# EAGLE design Relay_output_driver_modul_4ch (EAGLE 7.5.0)
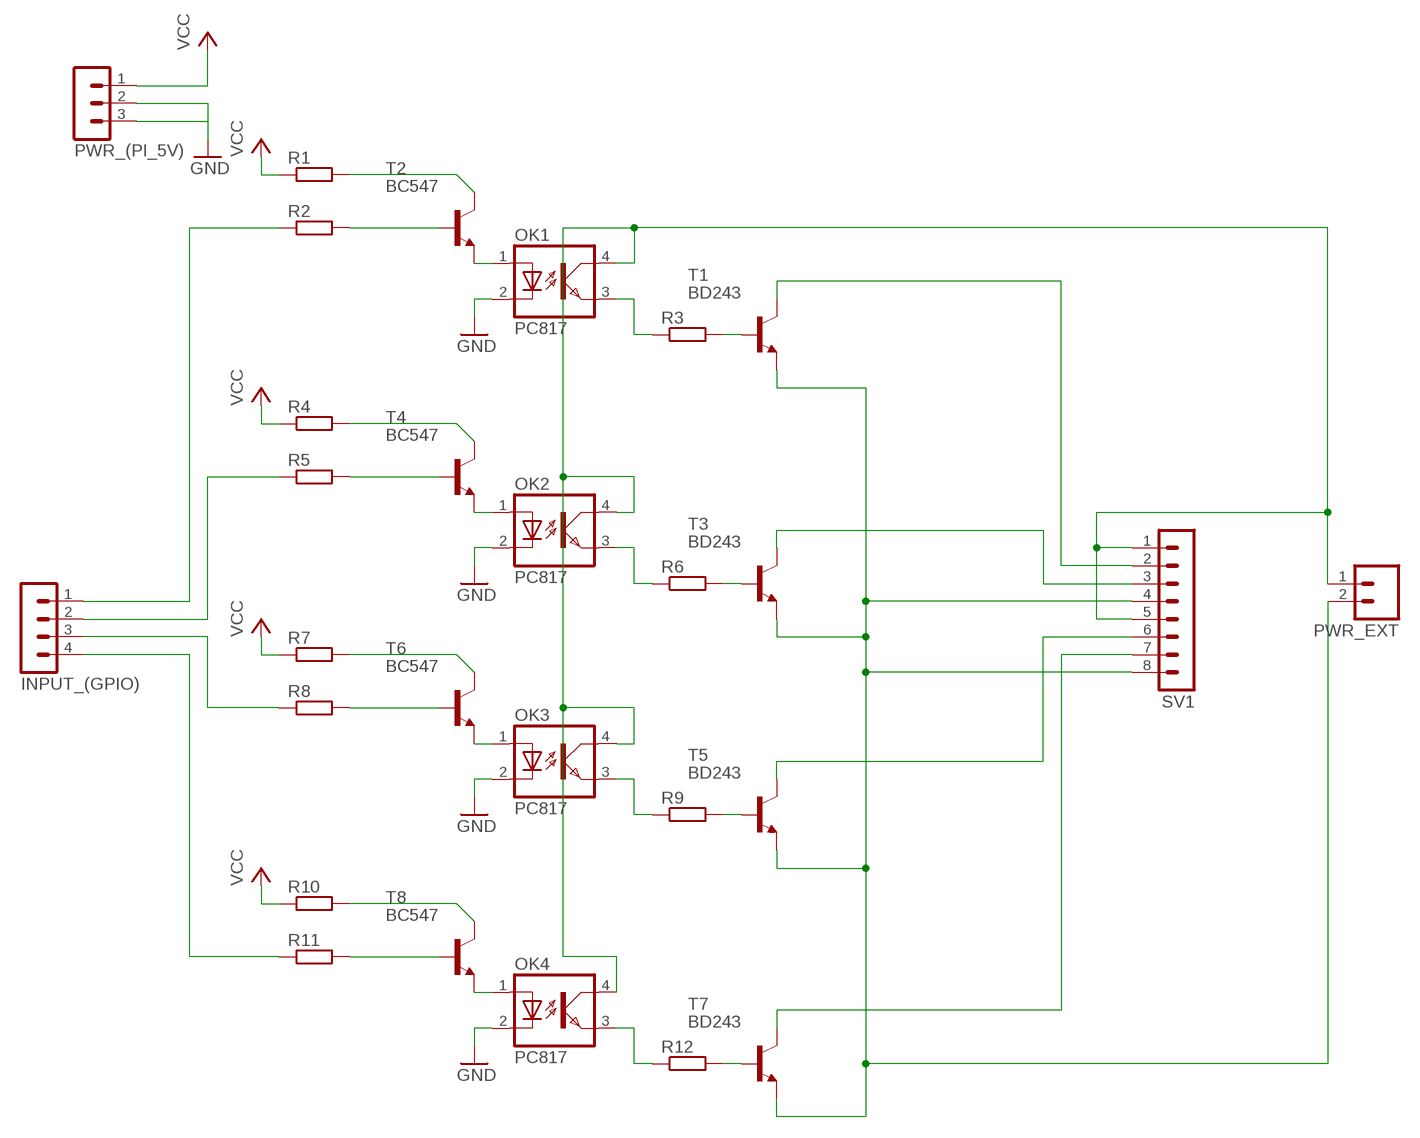
[diagram p0: schematic, sheet 1]

## Parts
INPUT_(GPIO)  MA04-1  [MA04-1]
OK1  PC817  [DIL04]
OK2  PC817  [DIL04]
OK3  PC817  [DIL04]
OK4  PC817  [DIL04]
PWR_(PI_5V)  MA03-1  [MA03-1]
PWR_EXT  MA02  [02PA]
R1  R-EU_0207/10  [0207/10]
R2  R-EU_0207/10  [0207/10]
R3  R-EU_0207/10  [0207/10]
R4  R-EU_0207/10  [0207/10]
R5  R-EU_0207/10  [0207/10]
R6  R-EU_0207/10  [0207/10]
R7  R-EU_0207/10  [0207/10]
R8  R-EU_0207/10  [0207/10]
R9  R-EU_0207/10  [0207/10]
R10  R-EU_0207/10  [0207/10]
R11  R-EU_0207/10  [0207/10]
R12  R-EU_0207/10  [0207/10]
SV1  MA08-1  [MA08-1]
T1  BD243  [TO220]
T2  BC547  [TO92]
T3  BD243  [TO220]
T4  BC547  [TO92]
T5  BD243  [TO220]
T6  BC547  [TO92]
T7  BD243  [TO220]
T8  BC547  [TO92]

## Nets
GND: OK1.2(C) OK2.2(C) OK3.2(C) OK4.2(C) PWR_(PI_5V).2 PWR_(PI_5V).3
INPUT_1: INPUT_(GPIO).1 R2.1
INPUT_2: INPUT_(GPIO).2 R5.1
INPUT_3: INPUT_(GPIO).3 R8.1
INPUT_4: INPUT_(GPIO).4 R11.1
N$1: OK1.1(A) T2.1(E)
N$2: R3.2 T1.1(B)
N$3: OK1.3(EMIT) R3.1
N$4: R2.2 T2.2(B)
N$5: R1.2 T2.3(C)
N$6: OK2.1(A) T4.1(E)
N$7: R6.2 T3.1(B)
N$8: OK2.3(EMIT) R6.1
N$9: R5.2 T4.2(B)
N$10: R4.2 T4.3(C)
N$11: OK3.1(A) T6.1(E)
N$12: R9.2 T5.1(B)
N$13: OK3.3(EMIT) R9.1
N$14: R8.2 T6.2(B)
N$15: R7.2 T6.3(C)
N$16: OK4.1(A) T8.1(E)
N$17: R12.2 T7.1(B)
N$18: OK4.3(EMIT) R12.1
N$19: R11.2 T8.2(B)
N$20: R10.2 T8.3(C)
OUTPUT_1: SV1.2 T1.2(C)
OUTPUT_2: SV1.3 T3.2(C)
OUTPUT_3: SV1.6 T5.2(C)
OUTPUT_4: SV1.7 T7.2(C)
PWR_EXT_5V: OK1.4(COL) OK2.4(COL) OK3.4(COL) OK4.4(COL) PWR_EXT.1 SV1.1 SV1.5
PWR_EXT_GND: PWR_EXT.2 SV1.4 SV1.8 T1.3(E) T3.3(E) T5.3(E) T7.3(E)
VCC: PWR_(PI_5V).1 R1.1 R4.1 R7.1 R10.1

## Library data of the parts
INPUT_(GPIO) = con-lstb:MA04-1: PIN HEADER; OC_FARNELL: unknown; OC_NEWARK: unknown
OK1-OK4 = optocoupler:PC817: SHARP OPTO COUPLER; MPN: PC817X4J000F; OC_FARNELL: 9707727; OC_NEWARK: 97K7059
PWR_(PI_5V) = con-lstb:MA03-1: PIN HEADER; OC_FARNELL: unknown; OC_NEWARK: unknown
PWR_EXT = con-amp-quick:MA02: AMP QUICK CONNECTOR; OC_FARNELL: unknown; OC_NEWARK: unknown
R1-R12 = rcl:R-EU_: RESISTOR, European symbol
SV1 = con-lstb:MA08-1: PIN HEADER; OC_FARNELL: unknown; OC_NEWARK: unknown
T1 T3 T5 T7 = transistor:BD243: NPN TRANSISTOR Source: Motorola Semiconductor, Master Selection Guide Q3/95 SG73 REV 8 page 5.5-4
T2 T4 T6 T8 = transistor:BC547: NPN TRANSISTOR

## Board
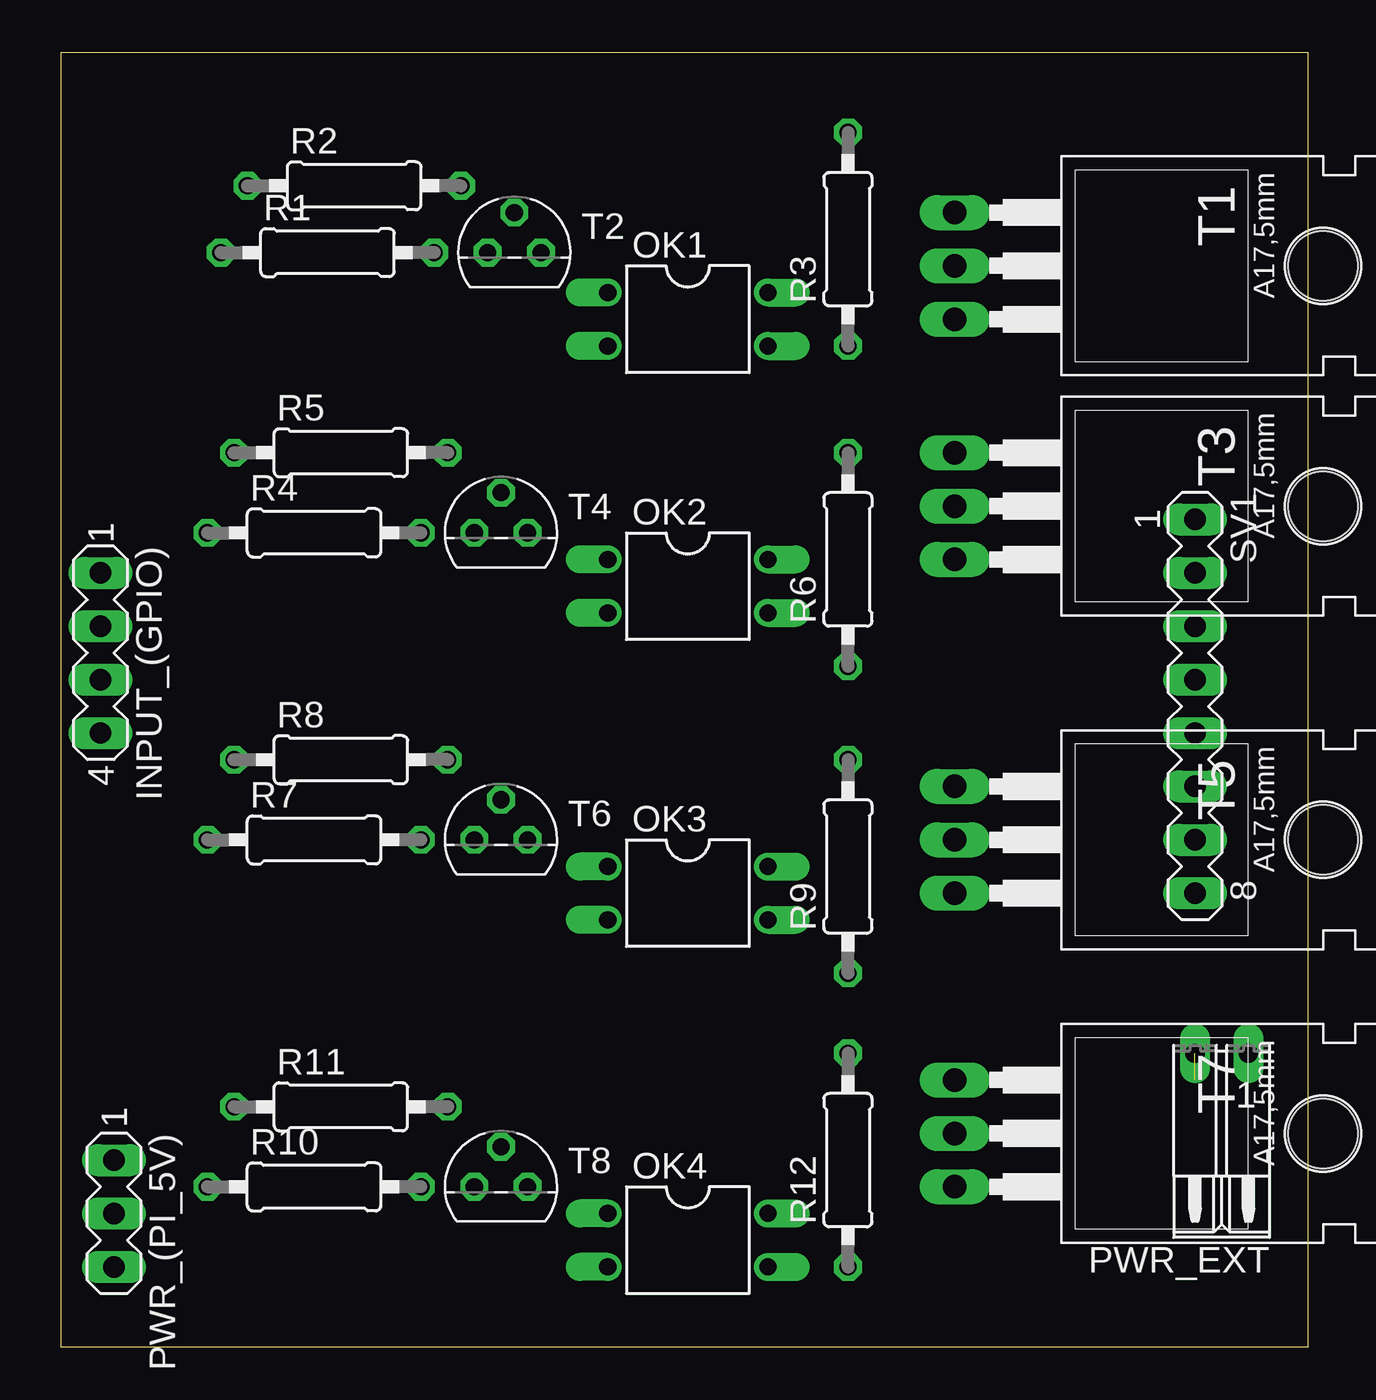
[diagram p1: board, top side]
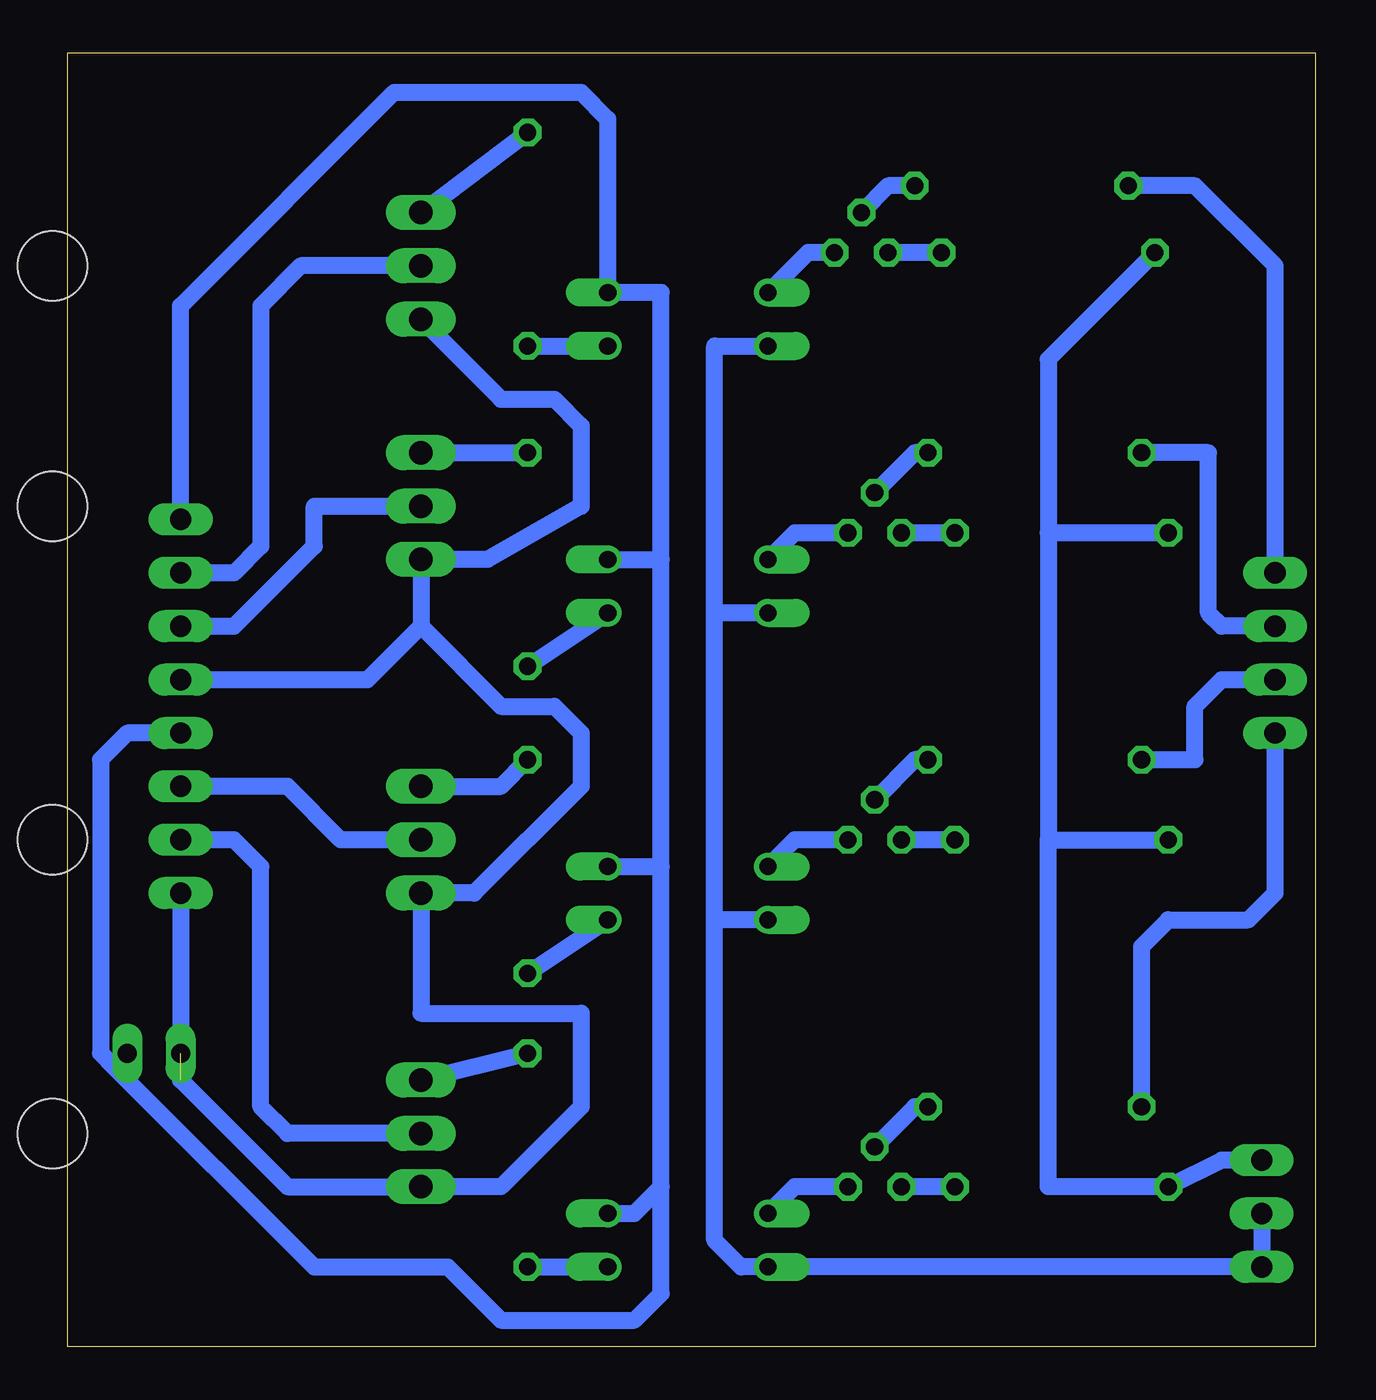
[diagram p2: board, bottom side, seen from below]

Size 59.36 x 61.59 mm. Coordinates in mm from the lower left corner, seen from the top.
Outline: 0,0 59.36,0 59.36,61.59 0,61.59 0,0
Copper layers (1*16): Top 0.035mm / dielectric 1.5mm / Bottom 0.035mm
Design rules "default": minimum track width 10mil, minimum drill 24mil, track to track 8mil, track to pad 8mil, pad to pad 8mil, via to via 8mil, smd to smd 8mil, copper to edge 40mil, drill to drill 8mil, minimum pad ring 10mil, minimum via ring 8mil, stop-mask expansion 4mil, vias tented up to drill 0mil, thermal gap 10mil

### Footprints (pad centres in the part's own frame; a part is rotated, then mirrored left to right if it is on the bottom)
MA04-1 = drill 1.016 long: 1 -3.81,0; 2 -1.27,0; 3 1.27,0; 4 3.81,0
DIL04 = drill 0.813 offset: 1 -1.27,-3.81; 2 1.27,-3.81; 3 1.27,3.81; 4 -1.27,3.81
MA03-1 = drill 1.016 long: 1 -2.54,0; 2 0,0; 3 2.54,0
02PA = drill 0.914 long: 1 -1.27,0; 2 1.27,0
0207/10 = drill 0.813 octagon: 1 -5.08,0; 2 5.08,0
MA08-1 = drill 1.016 long: 1 -8.89,0; 2 -6.35,0; 3 -3.81,0; 4 -1.27,0; 5 1.27,0; 6 3.81,0; 7 6.35,0; 8 8.89,0
TO220 = drill 1.118 long: 1 -2.54,-6.35; 2 0,-6.35; 3 2.54,-6.35 | hole 3.302: 0,11.176
TO92 = drill 0.813 octagon: 1 1.27,0; 2 0,1.905; 3 -1.27,0

### Placement (x,y rotation side)
INPUT_(GPIO)  1.91,33.02 270 top
OK1  29.84,48.9 270 top
OK2  29.84,36.2 270 top
OK3  29.84,21.59 270 top
OK4  29.84,5.08 270 top
PWR_(PI_5V)  2.54,6.35 270 top
PWR_EXT  55.24,13.97 180 top
R1  12.7,52.07 0 top
R2  13.97,55.24 0 top
R3  37.47,52.7 90 top
R4  12.06,38.73 0 top
R5  13.34,42.55 0 top
R6  37.47,37.47 90 top
R7  12.06,24.13 0 top
R8  13.34,27.94 0 top
R9  37.47,22.86 90 top
R10  12.06,7.62 0 top
R11  13.34,11.43 0 top
R12  37.47,8.89 90 top
SV1  53.98,30.48 270 top
T1  48.9,51.44 270 top
T2  21.59,52.07 0 top
T3  48.9,40.01 270 top
T4  20.95,38.73 0 top
T5  48.9,24.13 270 top
T6  20.95,24.13 0 top
T7  48.9,10.16 270 top
T8  20.95,7.62 0 top

### Tracks (layer width: path | path; a pad name or v marks a point on that pad's centre or on a via)
GND
  Bottom 0.813: 28.57,20.32 28.57,5.08 27.3,3.81 OK4.2 PWR_(PI_5V).3 PWR_(PI_5V).2 | 28.57,20.32 28.57,34.92 | 28.57,34.92 28.57,47.62 OK1.2 | OK3.2 28.57,20.32 | OK2.2 28.57,34.92
INPUT_1
  Bottom 0.813: INPUT_(GPIO).1 1.91,51.44 5.71,55.24 R2.1
INPUT_2
  Bottom 0.813: INPUT_(GPIO).2 4.45,34.29 5.08,34.92 5.08,42.55 R5.1
INPUT_3
  Bottom 0.813: R8.1 5.71,27.94 5.71,30.48 4.45,31.75 INPUT_(GPIO).3
INPUT_4
  Bottom 0.813: R11.1 8.26,19.05 6.99,20.32 3.17,20.32 1.91,21.59 INPUT_(GPIO).4
N$1
  Bottom 0.813: T2.1 24.13,52.07 OK1.1
N$2
  Bottom 0.813: T1.1 R3.2
N$3
  Bottom 0.813: R3.1 OK1.3
N$4
  Bottom 0.813: R2.2 20.32,55.24 T2.2
N$5
  Bottom 0.813: R1.2 T2.3
N$6
  Bottom 0.813: T4.1 24.77,38.73 OK2.1
N$7
  Bottom 0.813: T3.1 R6.2
N$8
  Bottom 0.813: R6.1 OK2.3
N$9
  Bottom 0.813: R5.2 19.05,42.55 T4.2
N$10
  Bottom 0.813: R4.2 T4.3
N$11
  Bottom 0.813: T6.1 24.77,24.13 OK3.1
N$12
  Bottom 0.813: T5.1 38.73,26.67 R9.2
N$13
  Bottom 0.813: R9.1 OK3.3
N$14
  Bottom 0.813: R8.2 19.05,27.94 T6.2
N$15
  Bottom 0.813: R7.2 T6.3
N$16
  Bottom 0.813: T8.1 24.77,7.62 OK4.1
N$17
  Bottom 0.813: T7.1 R12.2
N$18
  Bottom 0.813: R12.1 OK4.3
N$19
  Bottom 0.813: R11.2 19.05,11.43 T8.2
N$20
  Bottom 0.813: R10.2 T8.3
OUTPUT_1
  Bottom 0.813: T1.2 48.26,51.44 50.16,49.53 50.16,38.1 51.44,36.83 SV1.2
OUTPUT_2
  Bottom 0.813: SV1.3 51.44,34.29 47.62,38.1 47.62,40.01 T3.2
OUTPUT_3
  Bottom 0.813: T5.2 46.35,24.13 48.9,26.67 SV1.6
OUTPUT_4
  Bottom 0.813: T7.2 48.9,10.16 50.16,11.43 50.16,22.86 51.44,24.13 SV1.7
PWR_EXT_5V
  Bottom 0.813: OK4.4 32.38,6.35 31.11,7.62 | 31.11,7.62 31.11,22.86 | 31.11,22.86 31.11,37.47 | 31.11,37.47 31.11,50.16 OK1.4 33.66,58.42 34.92,59.69 43.81,59.69 53.98,49.53 SV1.1 | OK2.4 31.11,37.47 | OK3.4 31.11,22.86 | SV1.5 56.52,29.21 57.78,27.94 57.78,13.97 57.15,13.34 | 57.15,13.34 47.62,3.81 41.27,3.81 38.73,1.27 32.38,1.27 31.11,2.54 31.11,7.62 | 57.15,13.34 PWR_EXT.1
PWR_EXT_GND  (1 unrouted)
  Bottom 0.813: SV1.8 53.98,12.7 48.9,7.62 T7.3 38.73,7.62 34.92,11.43 34.92,15.88 42.55,15.88 T5.3 40.01,21.59 34.92,26.67 34.92,29.21 36.2,30.48 38.73,30.48 42.55,34.29 | 42.55,34.29 T3.3 39.37,37.47 34.92,40.01 34.92,43.81 36.2,45.09 38.73,45.09 T1.3 | SV1.4 45.09,31.75 42.55,34.29
VCC
  Bottom 0.813: 12.7,24.13 12.7,7.62 R10.1 4.45,8.89 PWR_(PI_5V).1 | 12.7,24.13 R7.1 | R4.1 12.7,38.73 | 12.7,38.73 12.7,24.13 | R1.1 12.7,46.99 12.7,38.73